# EAGLE design 2021-04-22 BOSS-Ion-Pump-Interface (EAGLE 9.6.2)

## Sheet 1 of 2: Circuit Board
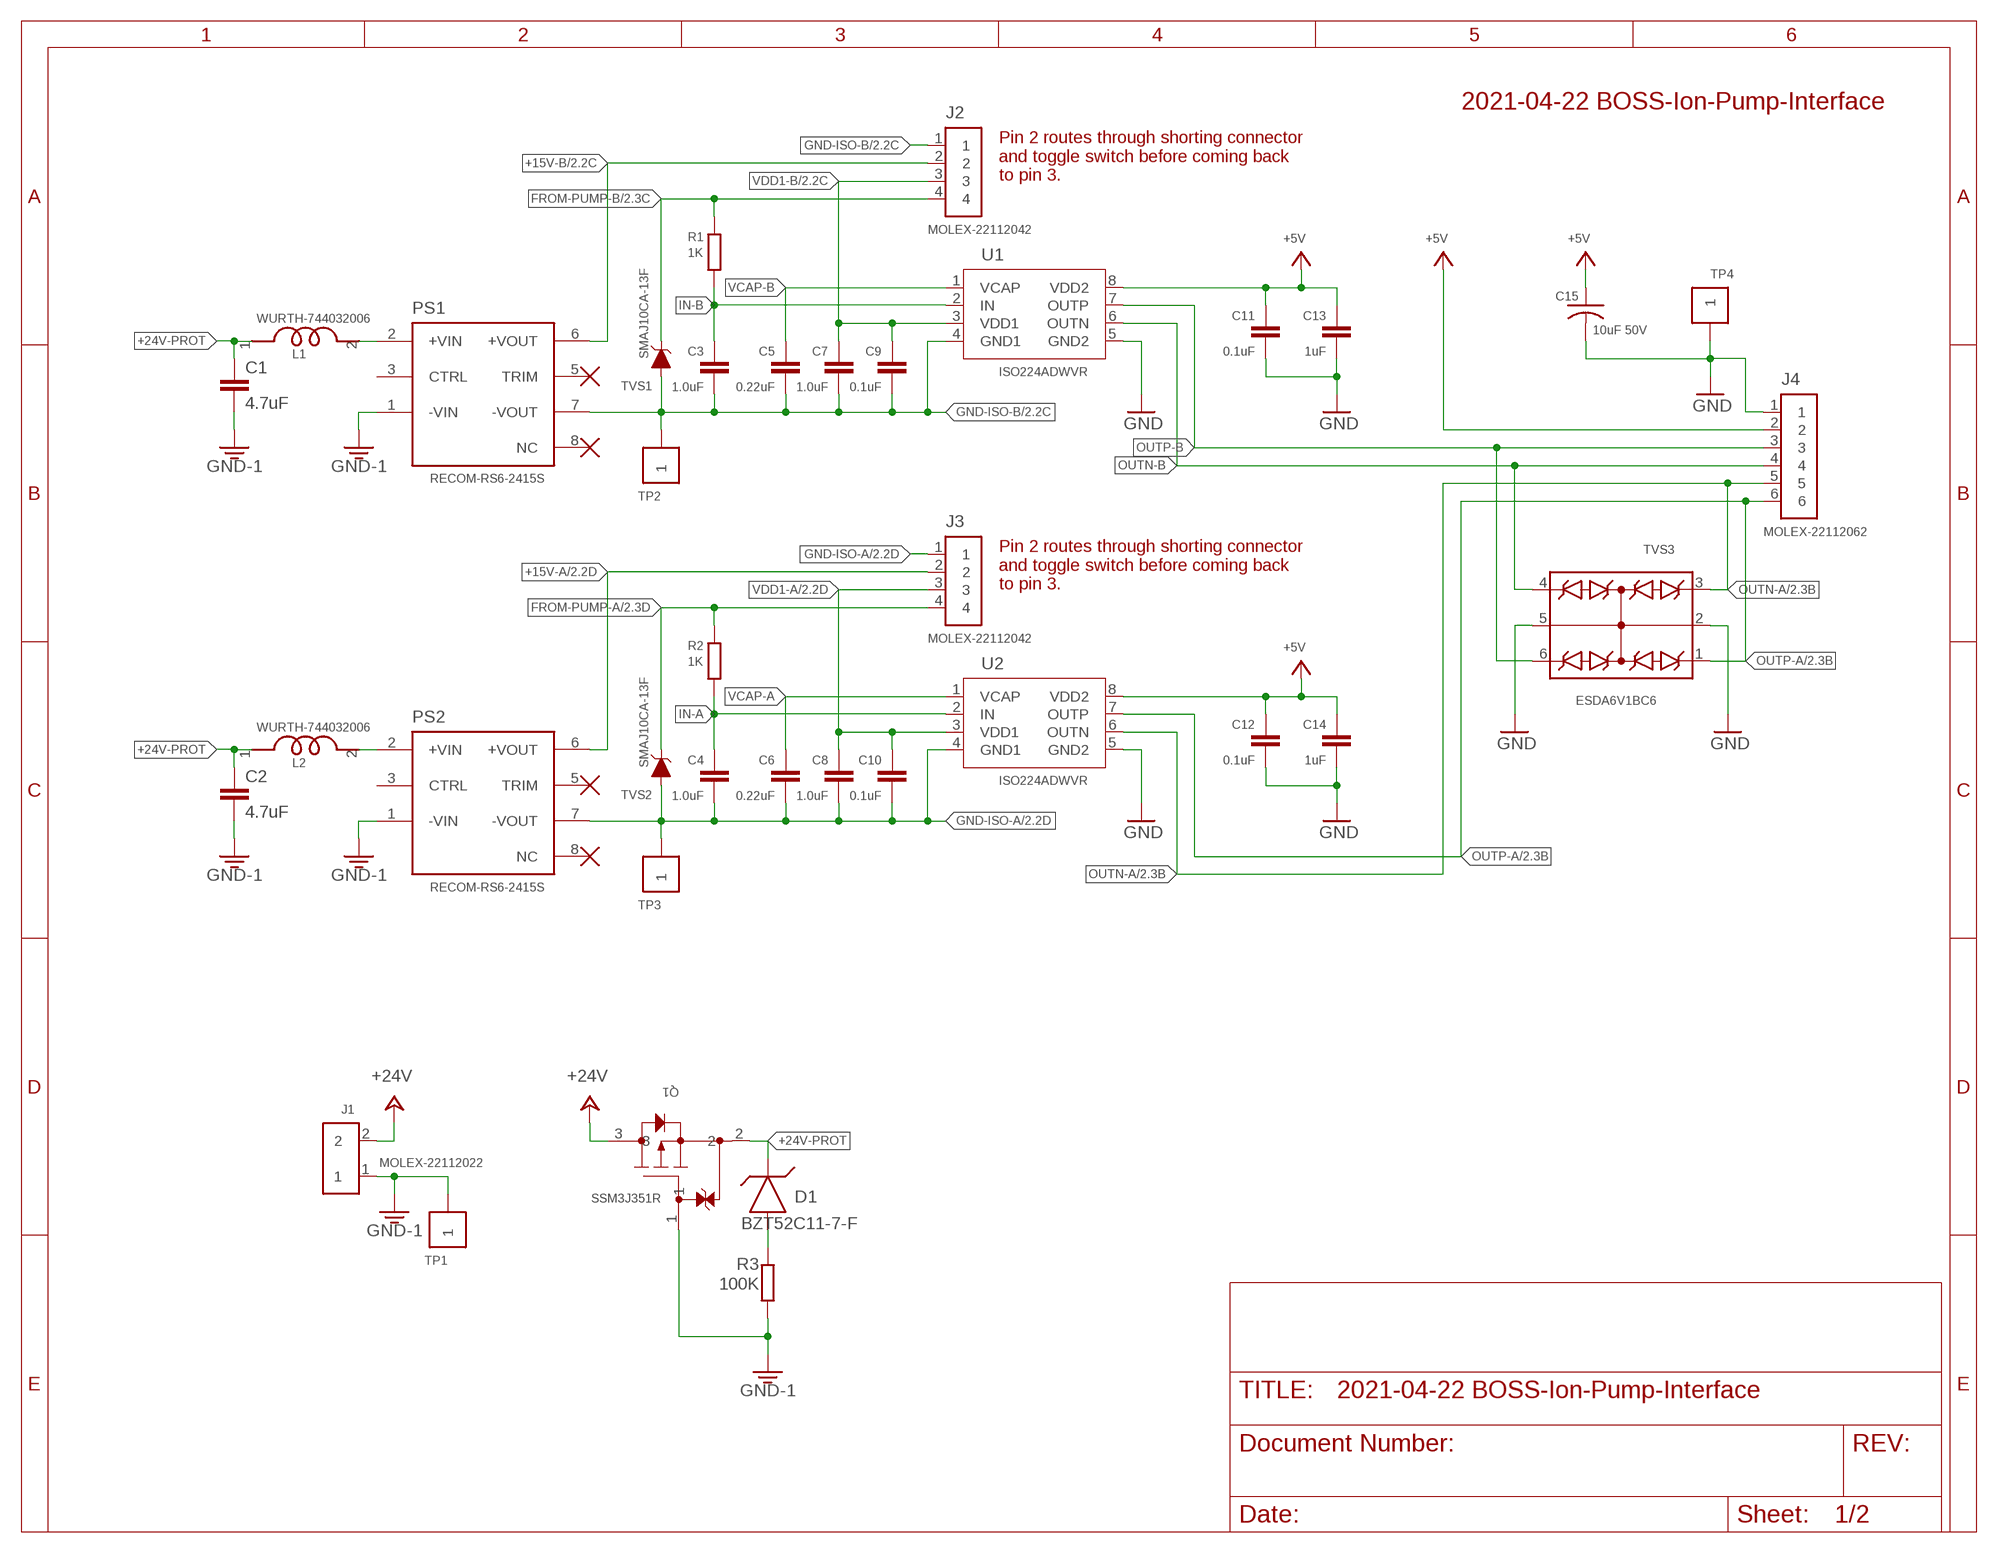
[diagram p0: schematic, sheet 1]

### Parts
C1  4.7uF  C-EUC1206  [C1206]
C2  4.7uF  C-EUC1206  [C1206]
C3  1.0uF  C-EUC0805  [C0805]
C4  1.0uF  C-EUC0805  [C0805]
C5  0.22uF  C-EUC1206  [C1206]
C6  0.22uF  C-EUC1206  [C1206]
C7  1.0uF  C-EUC1206  [C1206]
C8  1.0uF  C-EUC1206  [C1206]
C9  0.1uF  C-EUC1206  [C1206]
C10  0.1uF  C-EUC1206  [C1206]
C11  0.1uF  C-EUC0805  [C0805]
C12  0.1uF  C-EUC0805  [C0805]
C13  1uF  C-EUC0805  [C0805]
C14  1uF  C-EUC0805  [C0805]
C15  10uF 50V  C-USC1210  [C1210]
D1  BZT52C11-7-F  ZENER-BZT52C11-7-F  [SOD123_DIO]
J1  MOLEX-22112022  PINHD-1X2-MOLEX-22112022  [1X02-MOLEX-22112022]
J2  MOLEX-22112042  PINHD-1X4-MOLEX-22112042  [1X04-MOLEX-22112042]
J3  MOLEX-22112042  PINHD-1X4-MOLEX-22112042  [1X04-MOLEX-22112042]
J4  MOLEX-22112062  PINHD-1X6-MOLEX-22112062  [1X06-MOLEX-22112062]
L1  WURTH-744032006  INDUCTOR-WURTH-744032006  [WURTH-1210-INDUCTOR]
L2  WURTH-744032006  INDUCTOR-WURTH-744032006  [WURTH-1210-INDUCTOR]
PS1  RECOM-RS6-2415S  DC-DC-15V-RECOM-RS6-2415S  [CONV_RS6-2415S]
PS2  RECOM-RS6-2415S  DC-DC-15V-RECOM-RS6-2415S  [CONV_RS6-2415S]
Q1  SSM3J351R  P-MOSFET-SSM3J351R  [SOT-23F_TOS]
R1  1K  R-EU_R0805  [R0805]
R2  1K  R-EU_R0805  [R0805]
R3  100K  R-EU_R0805  [R0805]
TP1  TP5000-TESTPOINT-BLK  [TP5000-TESTPOINT-BLK]
TP2  TP5000-TESTPOINT-BLK  [TP5000-TESTPOINT-BLK]
TP3  TP5000-TESTPOINT-BLK  [TP5000-TESTPOINT-BLK]
TP4  TP5000-TESTPOINT-BLK  [TP5000-TESTPOINT-BLK]
TVS1  SMAJ10CA-13F  TVS-DIODE-SMAJ6.0CA-13-FSMA_DIO-M  [SMA_DIO-M]
TVS2  SMAJ10CA-13F  TVS-DIODE-SMAJ6.0CA-13-FSMA_DIO-M  [SMA_DIO-M]
TVS3  ESDA6V1BC6  TVS-QUAD-ESDA6V1BC6  [SOT95P280X145-6N]
U1  ISO224ADWVR  [DWV8_TEX]
U2  ISO224ADWVR  [DWV8_TEX]

### Nets
+5V [Power]: C11.1 C12.1 C13.1 C14.1 C15.1 J4.2 U1.8(VDD2) U2.8(VDD2) ; also sheet 2
+15V-A [Power]: J3.2 PS2.6(+VOUT) ; also sheet 2
+15V-B [Power]: J2.2 PS1.6(+VOUT) ; also sheet 2
+24V [Power]: J1.2 Q1.3
+24V-PROT: C1.1 C2.1 D1.1(C) L1.1 L2.1 Q1.2
+VIN-A [Power]: L2.2 PS2.2(+VIN)
+VIN-B [Power]: L1.2 PS1.2(+VIN)
FROM-PUMP-A: J3.4 R2.1 TVS2.1(C) ; also sheet 2
FROM-PUMP-B: J2.4 R1.1 TVS1.1(C) ; also sheet 2
GND [Power]: C11.2 C12.2 C13.2 C14.2 C15.2 J4.1 TP4.P$1 TVS3.2(CC1) TVS3.5(CC2) U1.5(GND2) U2.5(GND2) ; also sheet 2
GND-1 [Power]: C1.2 C2.2 J1.1 PS1.1(-VIN) PS2.1(-VIN) Q1.1 R3.1 TP1.P$1
GND-ISO-A [Power]: C4.2 C6.2 C8.2 C10.2 J3.1 PS2.7(-VOUT) TP3.P$1 TVS2.2(A) U2.4(GND1) ; also sheet 2
GND-ISO-B [Power]: C3.2 C5.2 C7.2 C9.2 J2.1 PS1.7(-VOUT) TP2.P$1 TVS1.2(A) U1.4(GND1) ; also sheet 2
IN-A: C4.1 R2.2 U2.2(IN)
IN-B: C3.1 R1.2 U1.2(IN)
OUTN-A: J4.5 TVS3.3(C2) U2.6(OUTN) ; also sheet 2
OUTN-B: J4.4 TVS3.4(C3) U1.6(OUTN)
OUTP-A: J4.6 TVS3.1(C1) U2.7(OUTP) ; also sheet 2
OUTP-B: J4.3 TVS3.6(C4) U1.7(OUTP)
REVERSE-POL-ZENER: D1.2(A) R3.2
VCAP-A: C6.1 U2.1(VCAP)
VCAP-B: C5.1 U1.1(VCAP)
VDD1-A [Power]: C8.1 C10.1 J3.3 U2.3(VDD1) ; also sheet 2
VDD1-B [Power]: C7.1 C9.1 J2.3 U1.3(VDD1) ; also sheet 2
Unconnected: PS1.3(CTRL) PS1.5(TRIM) PS1.8(NC) PS2.3(CTRL) PS2.5(TRIM) PS2.8(NC)

### Notes on the sheet
- 2021-04-22 BOSS-Ion-Pump-Interface
- Pin 2 routes through shorting connector
  and toggle switch before coming back
  to pin 3.
- Pin 2 routes through shorting connector
  and toggle switch before coming back
  to pin 3.

## Sheet 2 of 2: External Connections
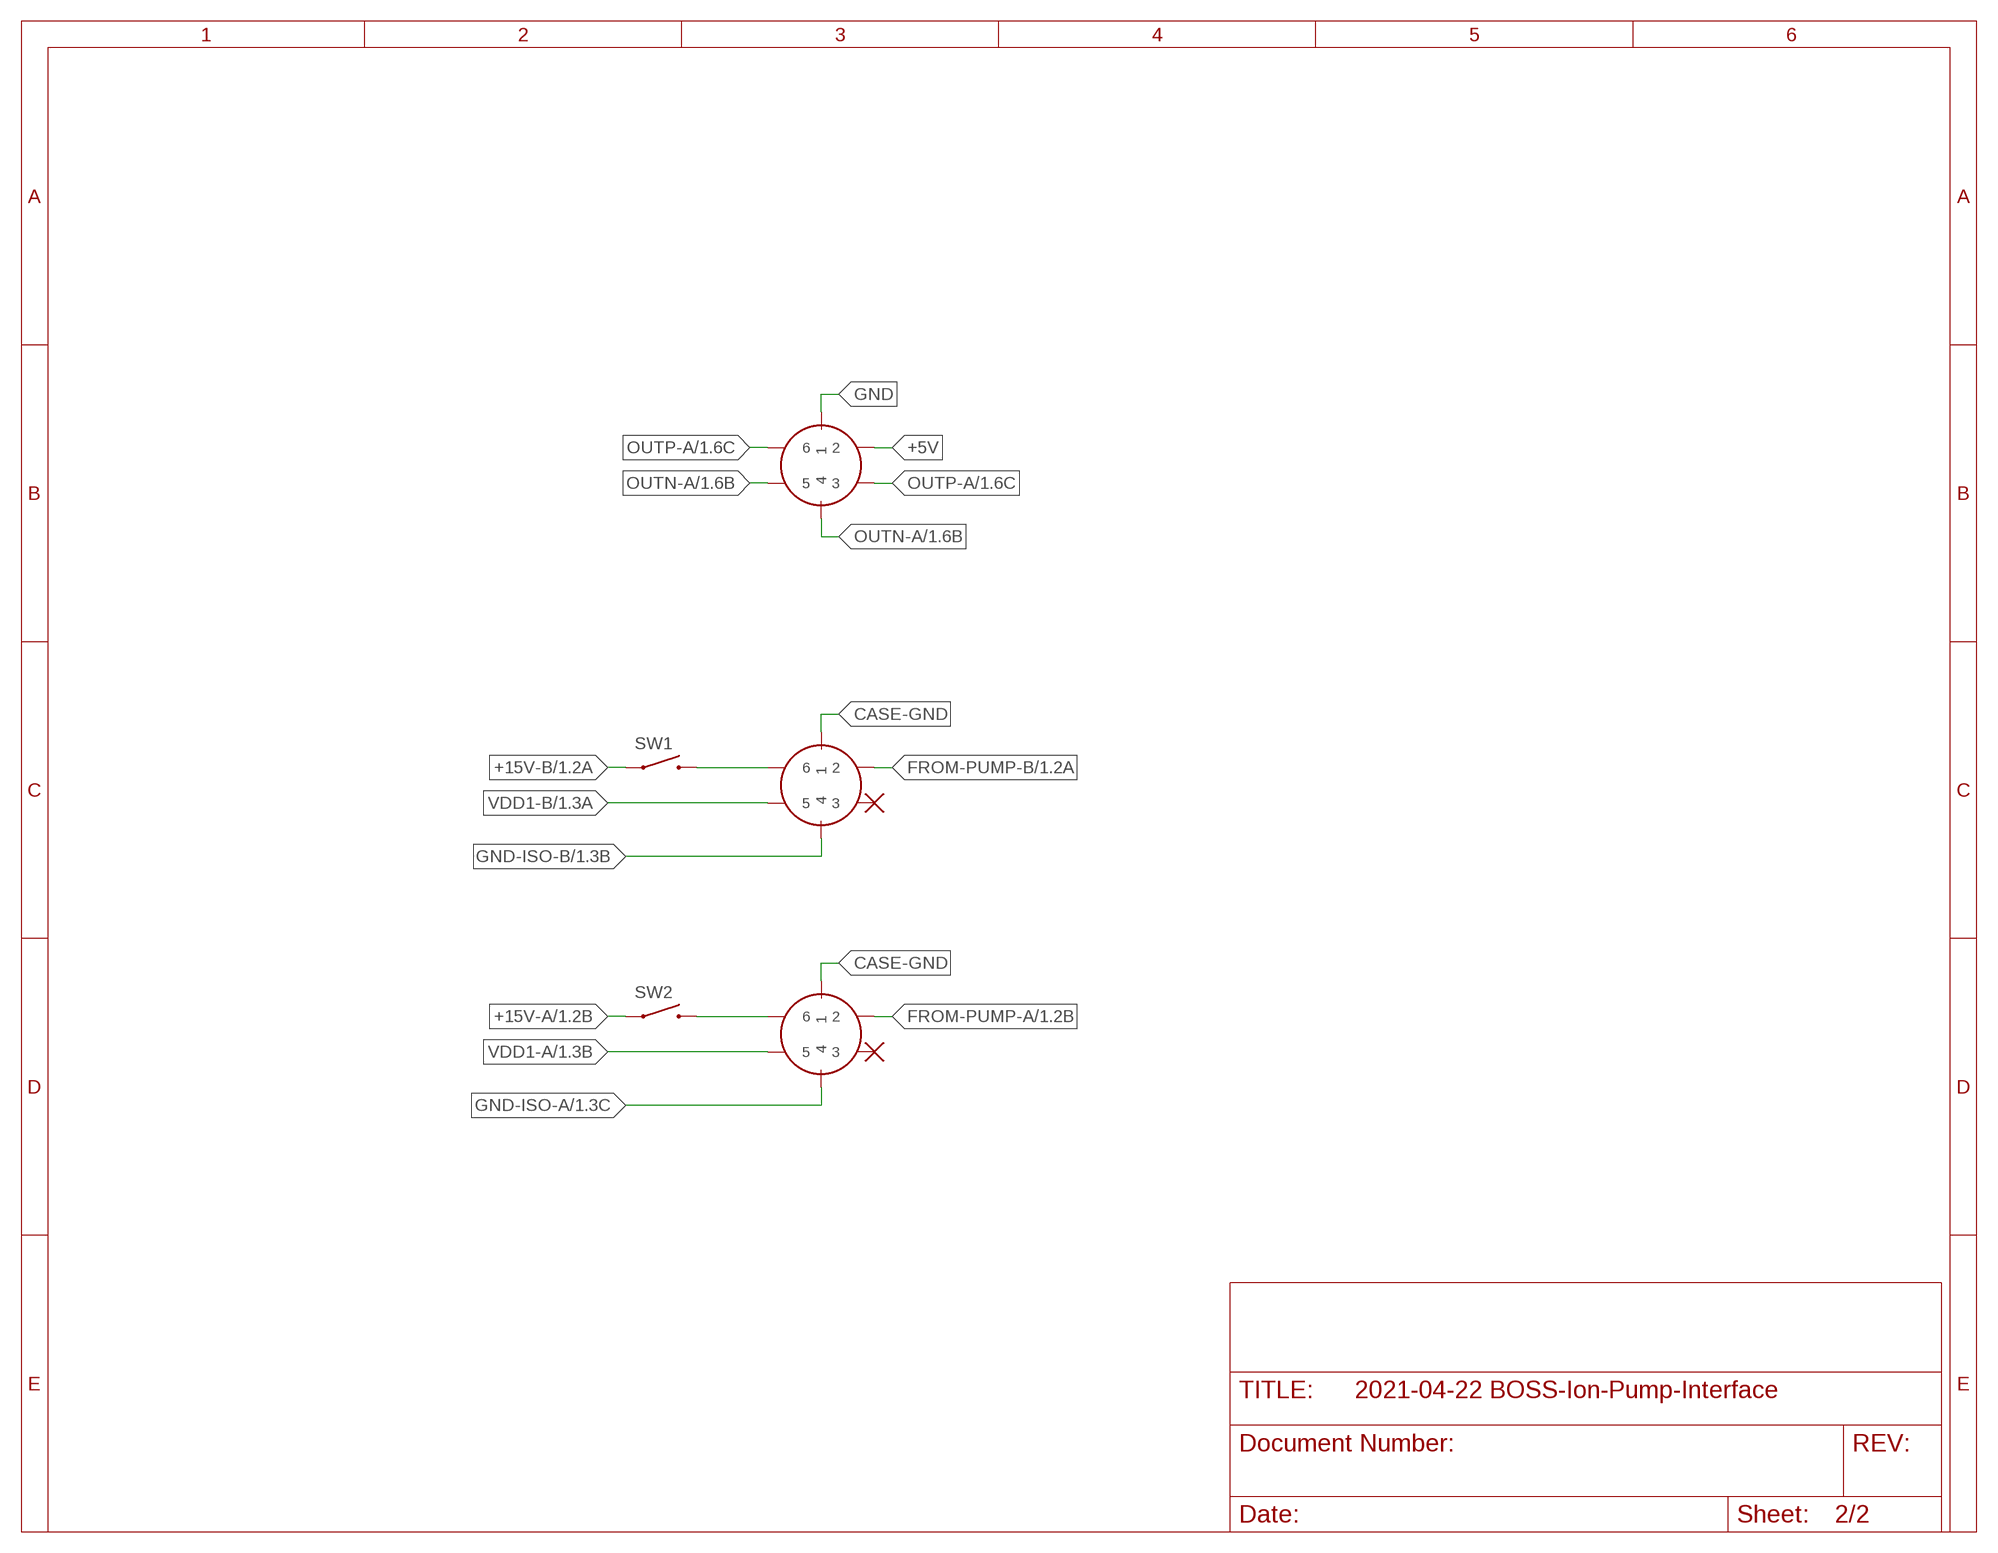
[diagram p1: schematic, sheet 2]

### Parts
SW1  SPST-OFFBOARD  (no package)
SW2  SPST-OFFBOARD  (no package)
U$8  CON-CIRCULAR-6-OFF-BOARD  (no package)
U$9  CON-CIRCULAR-6-OFF-BOARD  (no package)
U$11  CON-CIRCULAR-6-OFF-BOARD  (no package)

### Nets
+5V [Power]: U$11.2 ; also sheet 1
+15V-A [Power]: SW2.1 ; also sheet 1
+15V-B [Power]: SW1.1 ; also sheet 1
CASE-GND: U$8.1 U$9.1
FROM-PUMP-A: U$9.2 ; also sheet 1
FROM-PUMP-B: U$8.2 ; also sheet 1
GND [Power]: U$11.1 ; also sheet 1
GND-ISO-A [Power]: U$9.4 ; also sheet 1
GND-ISO-B [Power]: U$8.4 ; also sheet 1
N$1 [Power]: SW1.2 U$8.6
N$2 [Power]: SW2.2 U$9.6
OUTN-A: U$11.4 U$11.5 ; also sheet 1
OUTP-A: U$11.3 U$11.6 ; also sheet 1
VDD1-A [Power]: U$9.5 ; also sheet 1
VDD1-B [Power]: U$8.5 ; also sheet 1
Unconnected: U$8.3 U$9.3

## Library data of the parts
C1-C14 = AUmlib:C-EU: CAPACITOR, European symbol; SPICEPREFIX: C
C15 = AUmlib:C-US: CAPACITOR, American symbol; SPICEPREFIX: C
D1 = AUmlib:ZENER-BZT52C11-7-F; BUILT_BY: EMA_UL_Team; MANUFACTURER_PART_NUMBER: BZT52C11-7-F; SOURCELIBRARY: DiodesInc_2015-05-08; VENDOR: Diodes Inc
J1 = AUmlib:PINHD-1X2-MOLEX-22112022
J2 J3 = AUmlib:PINHD-1X4-MOLEX-22112042
J4 = AUmlib:PINHD-1X6-MOLEX-22112062
L1 L2 = AUmlib:INDUCTOR-WURTH-744032006
PS1 PS2 = AUmlib:DC-DC-15V-RECOM-RS6-2415S: 6 Watt SIP8 Single and Dual Output; DESCRIPTION: 6W DC/DC-Converter 'ECONOLINE' SIP8 2kV reg 2:1; DIGI-KEY_PART_NUMBER: 945-2987-ND; MF: Recom Power; MP: RS6-2415S; PACKAGE: SIP-8 Recom Power; PURCHASE-URL: https://pricing.snapeda.com/search/part/RS6-2415S/?ref=eda
Q1 = AUmlib:P-MOSFET-SSM3J351R; MANUFACTURER_PART_NUMBER: SSM3J351R; SOURCELIBRARY: Toshiba_2018-12-14; VENDOR: Toshiba
R1-R3 = AUmlib:R-EU_: RESISTOR, European symbol; SPICEPREFIX: R
SW1 SW2 = AUmlib:SPST-OFFBOARD
TP1-TP4 = AUmlib:TP5000-TESTPOINT-BLK
TVS1 TVS2 = AUmlib:TVS-DIODE-SMAJ6.0CA-13-F: TVS Diode; BUILT_BY: EMA_UL_Team; MANUFACTURER_PART_NUMBER: SMAJ6.0CA-13-F; SOURCELIBRARY: DiodesInc_2015-05-08; VENDOR: Diodes Inc
TVS3 = AUmlib:TVS-QUAD-ESDA6V1BC6: Clamp Ipp Tvs Diode Surface Mount SOT-23-6; DESCRIPTION: Clamp Ipp Tvs Diode Surface Mount SOT-23-6; DIGI-KEY_PART_NUMBER: 497-6635-1-ND; MF: STMicroelectronics; MP: ESDA6V1BC6; PACKAGE: SOT-23-6 STMicroelectronics; PURCHASE-URL: https://pricing.snapeda.com/search/part/ESDA6V1BC6/?ref=eda
U1 U2 = AUmlib:ISO224ADWVR; BUILT_BY: EMA_Jessica; COPYRIGHT: Copyright (C) 2018 Accelerated Designs. All rights reserved; MANUFACTURER_PART_NUMBER: ISO224ADWVR; SOURCELIBRARY: TI_2020-05-18; VENDOR: Texas Instruments
U$8 U$9 U$11 = AUmlib:CON-CIRCULAR-6-OFF-BOARD

## Net classes
1 Power: width 0.508 mm, drill 0.35 mm, clearance 0.254 mm

## Board
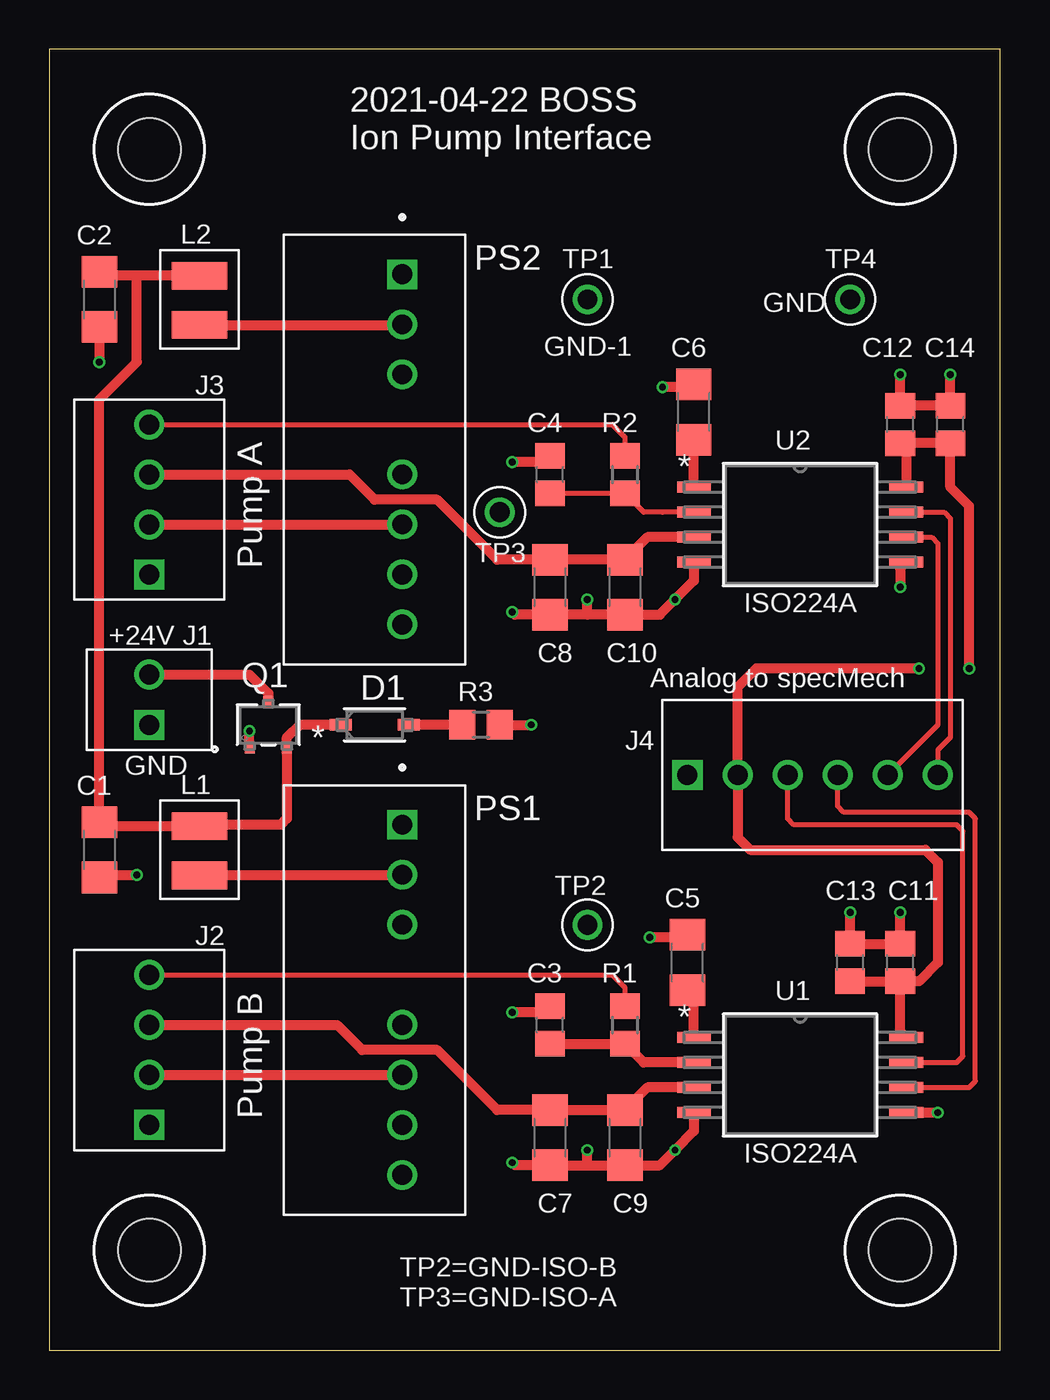
[diagram p2: board, top side]
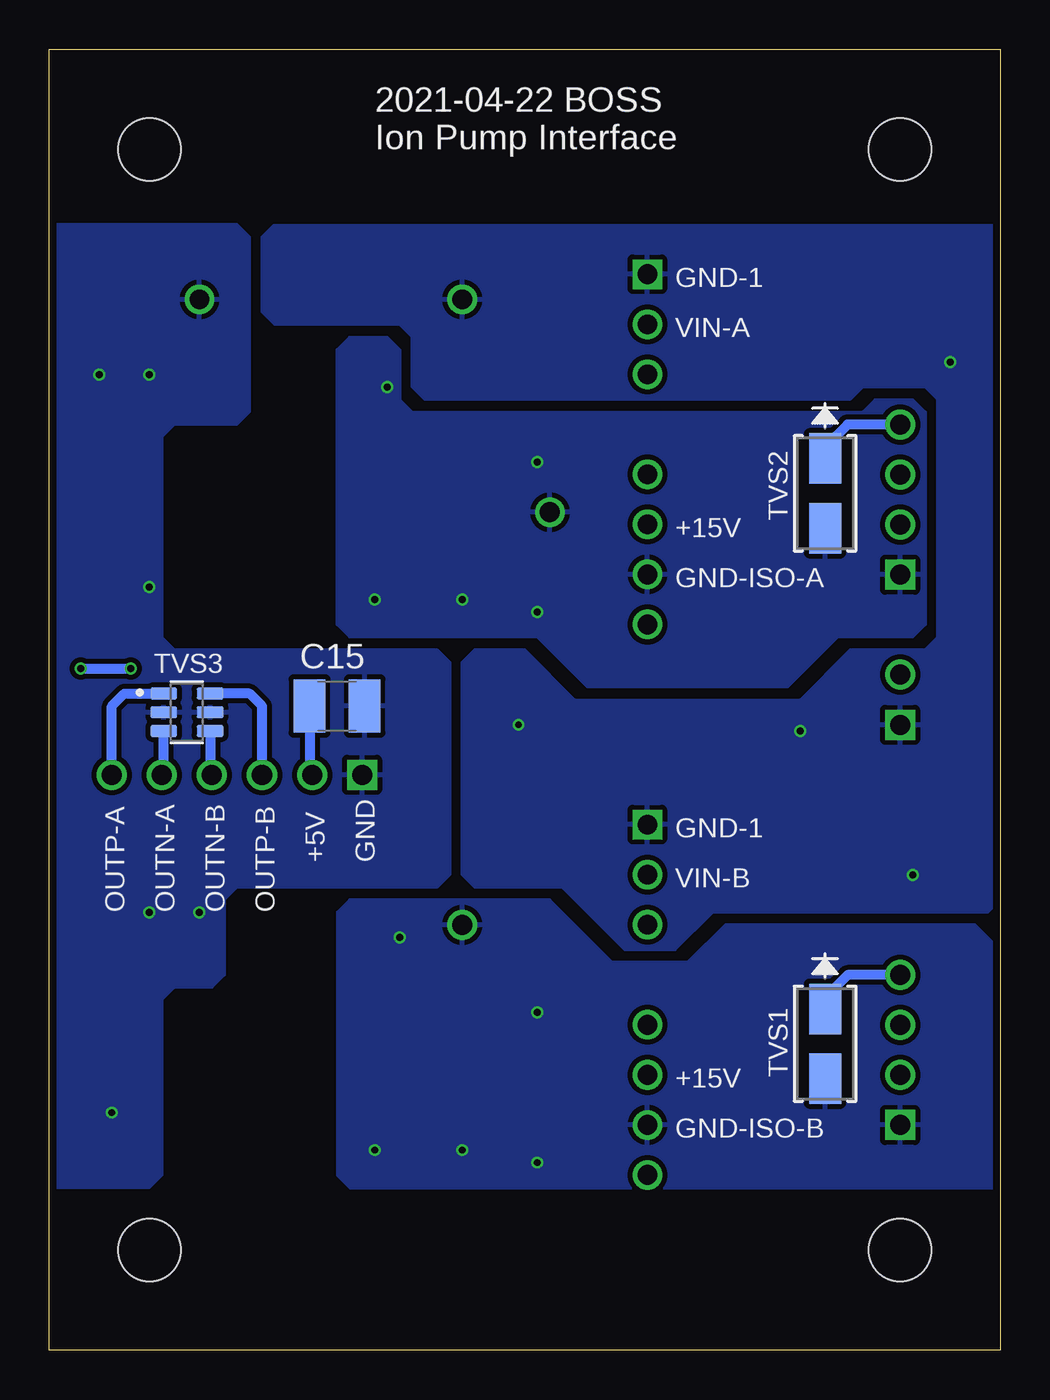
[diagram p3: board, bottom side, seen from below]

Size 48.26 x 66.04 mm. Coordinates in mm from the lower left corner, seen from the top.
Outline: 0,0 48.26,0 48.26,66.04 0,66.04 0,0
Copper layers (1*16): Top 0.035559375mm / dielectric 1.6mm / Bottom 0.035559375mm
Design rules "oshpark-2layer": minimum track width 6mil, minimum drill 10mil, track to track 6mil, track to pad 6mil, pad to pad 6mil, via to via 6mil, smd to smd 6mil, copper to edge 15mil, drill to drill 6mil, minimum pad ring 5mil, minimum via ring 5mil, stop-mask expansion 2.5mil, vias tented up to drill 0mil, thermal gap 10mil
Holes 3.17 mm at 5.08,5.08 5.08,60.96 43.18,5.08 43.18,60.96

### Footprints (pad centres in the part's own frame; a part is rotated, then mirrored left to right if it is on the bottom)
C1206 = smd 1.6 x 1.8: 1 -1.4,0; 2 1.4,0
C0805 = smd 1.3 x 1.5: 1 -0.95,0; 2 0.95,0
C1210 = smd 1.6 x 2.7: 1 -1.4,0; 2 1.4,0
SOD123_DIO = smd 1.111 x 0.601: 1 -1.725,0; 2 1.725,0
1X02-MOLEX-22112022 = drill 1.016 square: 1 -1.27,0 | drill 1.016: 2 1.27,0
1X04-MOLEX-22112042 = drill 1.016 square: 1 0,0 | drill 1.016: 2 2.54,0; 3 5.08,0; 4 7.62,0
1X06-MOLEX-22112062 = drill 1.016 square: 1 -5.08,0 | drill 1.016: 2 -2.54,0; 3 0,0; 4 2.54,0; 5 5.08,0; 6 7.62,0
WURTH-1210-INDUCTOR = smd 1.4 x 2.8: 1 -1.2,0; 2 1.3,0
CONV_RS6-2415S = drill 1 square: 1 -8.9,1.4 | drill 1: 2 -6.36,1.4; 3 -3.82,1.4; 5 1.26,1.4; 6 3.8,1.4; 7 6.34,1.4; 8 8.88,1.4
SOT-23F_TOS = smd 0.508 x 0.508: 1 -0.95,-1.194; 2 0.95,-1.194; 3 0,1.194
R0805 = smd 1.3 x 1.5: 1 -0.95,0; 2 0.95,0
TP5000-TESTPOINT-BLK = drill 1: P$1 0,0
SMA_DIO-M = smd 2.561 x 1.63: 1 -1.768,0; 2 1.768,0
SOT95P280X145-6N = smd 1.36 x 0.6: 1 -1.175,0.95; 2 -1.175,0; 3 -1.175,-0.95; 4 1.175,-0.95; 5 1.175,0; 6 1.175,0.95
DWV8_TEX = smd 1.702 x 0.559: 1 -5.385,1.905; 2 -5.385,0.635; 3 -5.385,-0.635; 4 -5.385,-1.905; 5 5.385,-1.905; 6 5.385,-0.635; 7 5.385,0.635; 8 5.385,1.905

### Placement (x,y rotation side)
C1  2.54,25.4 270 top
C2  2.54,53.34 270 top
C3  25.4,16.51 90 top
C4  25.4,44.45 90 top
C5  32.38,19.68 90 top
C6  32.7,47.62 90 top
C7  25.4,10.79 270 top
C8  25.4,38.73 270 top
C9  29.21,10.79 270 top
C10  29.21,38.73 270 top
C11  43.18,19.68 90 top
C12  43.18,46.99 90 top
C13  40.64,19.68 90 top
C14  45.72,46.99 90 top
C15  33.66,32.7 0 bottom
D1  16.51,31.75 0 top
J1  5.08,33.02 90 top
J2  5.08,11.43 90 top
J3  5.08,39.37 90 top
J4  37.47,29.21 0 top
L1  7.62,25.4 270 top
L2  7.62,53.34 270 top
PS1  16.51,17.78 270 top
PS2  16.51,45.72 270 top
Q1  11.11,31.75 0 top
R1  29.21,16.51 270 top
R2  29.21,44.45 270 top
R3  21.91,31.75 180 top
TP1  27.3,53.34 0 top
TP2  27.3,21.59 0 top
TP3  22.86,42.55 0 top
TP4  40.64,53.34 0 top
TVS1  8.89,15.56 270 bottom
TVS2  8.89,43.5 270 bottom
TVS3  41.27,32.38 0 bottom
U1  38.1,13.97 0 top
U2  38.1,41.91 0 top

### Tracks (layer width: path | path; a pad name or v marks a point on that pad's centre or on a via)
+5V  (via drill 0.35)
  Top 0.508: U2.8 43.48,45.73 C12.1 C14.1 45.72,43.81 46.67,42.86 v46.67,34.61 | C13.1 C11.1 | U1.8 43.18,16.18 C11.1 | C11.1 44.13,18.73 45.09,19.68 45.09,24.77 44.45,25.4 35.56,25.4 34.92,26.04 J4.2 34.92,33.66 35.88,34.61 v44.13,34.61
  Bottom 0.508: v46.67,34.61 v44.13,34.61 | C15.1 35.05,29.34 J4.2
+15V-A
  Top 0.508: J3.2 PS2.6
+15V-B
  Top 0.508: J2.2 PS1.6
+24V
  Top 0.508: J1.2 10.16,34.29 11.11,33.34 Q1.3
+24V-PROT
  Top 0.508: L2.1 4.45,54.54 | 4.45,54.54 2.74,54.54 C2.1 | 4.45,54.54 4.45,50.16 2.54,48.26 C1.1 2.74,26.6 L1.1 7.55,26.67 11.75,26.67 12.06,26.98 Q1.2 12.06,31.11 12.7,31.75 D1.1
+VIN-A
  Top 0.508: L2.2 17.87,52.04 PS2.2
+VIN-B
  Top 0.508: L1.2 7.66,24.14 PS1.2
FROM-PUMP-A
  Top 0.254: R2.1 29.21,46.35 28.57,46.99 J3.4
  Bottom 0.508: TVS2.1 8.35,45.8 8.35,46.38 7.74,46.99 J3.4
FROM-PUMP-B
  Top 0.254: R1.1 29.21,18.41 28.57,19.05 J2.4
  Bottom 0.508: TVS1.1 8.35,17.86 8.35,18.44 7.74,19.05 J2.4
GND  (via drill 0.35)
  Top 0.508: U2.5 43.18,39.7 v43.18,38.73 | v43.18,22.23 C11.2 C13.2 v40.64,22.23 | U1.5 v45.09,12.06 | v45.72,49.53 C14.2 C12.2 v43.18,49.53
  pour Bottom: 48.26,57.15 38.73,57.15 38.1,56.52 38.1,47.62 38.73,46.99 41.91,46.99 42.55,46.35 42.55,36.2 41.91,35.56 28.57,35.56 27.94,34.92 27.94,24.13 28.57,23.5 38.73,23.5 39.37,22.86 39.37,19.05 40.01,18.41 41.91,18.41 42.55,17.78 42.55,8.89 43.18,8.26 48.26,8.26
GND-1  (via drill 0.35)
  Top 0.508: C1.2 2.67,24.13 v4.45,24.13 | C2.2 v2.54,50.16 | R3.1 v24.45,31.75 | Q1.1 v10.16,31.43
  pour Bottom: 0,22.86 0.64,22.23 14.61,22.23 16.51,20.32 19.05,20.32 22.23,23.5 26.67,23.5 27.3,24.13 27.3,34.92 26.67,35.56 24.13,35.56 21.59,33.02 10.16,33.02 7.62,35.56 3.81,35.56 3.17,36.2 3.17,48.26 3.81,48.9 6.99,48.9 7.62,48.26 29.21,48.26 29.84,48.9 29.84,51.44 30.48,52.07 36.83,52.07 37.47,52.7 37.47,56.52 36.88,57.1 0,57.1
GND-ISO-A  (via drill 0.35)
  Top 0.508: C4.2 25.09,45.09 v23.5,45.09 | C6.2 32.57,48.9 v31.11,48.9 | U2.4 32.72,39.06 v31.75,38.1 30.98,37.34 C10.2 27.3,37.34 | 27.3,37.34 C8.2 23.62,37.34 v23.5,37.47 | 27.3,37.34 v27.3,38.1
  pour Bottom: 33.02,36.2 33.66,36.83 33.66,50.8 33.02,51.44 31.11,51.44 30.48,50.8 30.48,48.26 29.84,47.62 6.99,47.62 6.35,48.26 4.45,48.26 3.81,47.62 3.81,36.83 4.45,36.2 8.26,36.2 10.79,33.66 20.95,33.66 23.5,36.2
GND-ISO-B  (via drill 0.35)
  Top 0.508: C3.2 25.09,17.14 v23.5,17.14 | C5.2 32.26,20.95 v30.48,20.95 | 27.3,9.39 C7.2 23.62,9.39 v23.5,9.53 | 27.3,9.39 C9.2 30.98,9.39 v31.75,10.16 32.72,11.12 U1.4 | 27.3,9.39 v27.3,10.16
  pour Bottom: 0,8.26 0,20.32 1.27,21.59 13.97,21.59 15.88,19.68 19.68,19.68 22.86,22.86 33.02,22.86 33.66,22.23 33.66,8.89 33.02,8.26
IN-A
  Top 0.254: U2.2 31.11,42.55 30.16,42.55 R2.2 C4.1
IN-B
  Top 0.508: U1.2 30.16,14.61 R1.2 C3.1
OUTN-A
  Top 0.254: U2.6 44.77,41.27 45.09,40.96 45.09,31.75 J4.5
  Bottom 0.508: J4.5 42.45,29.3 TVS3.3
OUTN-B
  Top 0.254: U1.6 46.67,13.34 46.99,13.65 46.99,26.99 46.67,27.3 40.32,27.3 40.01,27.62 J4.4
  Bottom 0.508: TVS3.4 40.1,29.3 J4.4
OUTP-A
  Top 0.254: U2.7 45.4,42.55 45.72,42.23 45.72,31.11 45.09,30.48 J4.6
  Bottom 0.508: TVS3.1 44.45,33.34 45.09,32.7 J4.6
OUTP-B
  Top 0.254: U1.7 46.04,14.61 46.35,14.92 46.35,26.35 46.04,26.67 37.78,26.67 37.47,26.99 J4.3
  Bottom 0.508: J4.3 37.47,32.7 38.1,33.34 TVS3.6
REVERSE-POL-ZENER
  Top 0.508: R3.2 D1.2
VCAP-A
  Top 0.508: U2.1 32.7,43.83 C6.1
VCAP-B
  Top 0.508: U1.1 32.72,17.95 C5.1
VDD1-A
  Top 0.508: J3.3 15.24,44.45 16.51,43.18 19.68,43.18 22.73,40.13 C8.1 C10.1 30.35,41.27 U2.3
VDD1-B
  Top 0.508: J2.3 14.61,16.51 15.88,15.24 19.68,15.24 22.73,12.2 C7.1 C9.1 30.35,13.34 U1.3

### Text on the board
tPlace: 2021-04-22 BOSS / Ion Pump Interface | GND | GND-1 | Pump A | +24V | ISO224A | Analog to specMech | GND | Pump B | ISO224A | TP2=GND-ISO-B / TP3=GND-ISO-A
bPlace: 2021-04-22 BOSS / Ion Pump Interface | GND-1 | VIN-A | +15V | GND-ISO-A | GND-1 | GND | +5V | VIN-B | OUTP-B | OUTN-B | OUTN-A | OUTP-A | +15V | GND-ISO-B